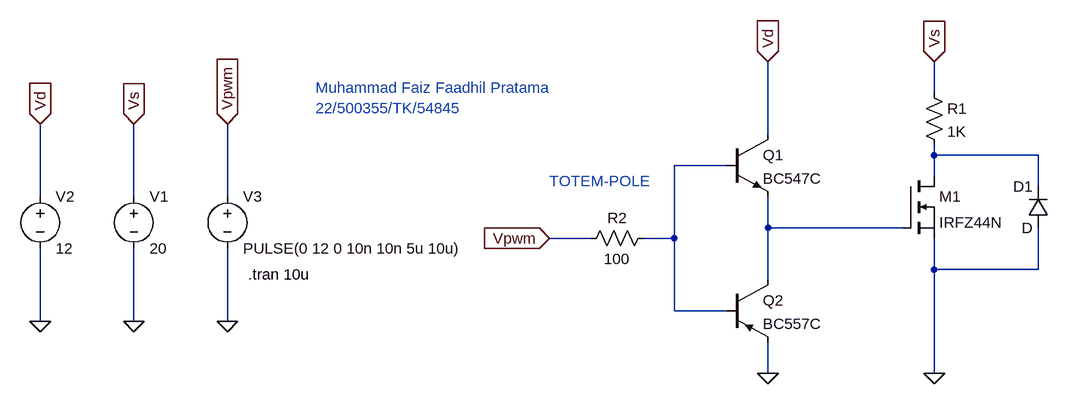
[diagram p0: schematic TOTEM_POLE.asc]
TOTEM_POLE.asc, the LTspice schematic file:
Version 4
SHEET 1 932 680
WIRE 752 -384 752 -432
WIRE 496 -320 496 -432
WIRE 752 -288 752 -304
WIRE 912 -288 752 -288
WIRE 432 -272 352 -272
WIRE 752 -256 752 -288
WIRE 912 -240 912 -288
WIRE -624 -224 -624 -336
WIRE -480 -224 -480 -336
WIRE -336 -224 -336 -336
WIRE 496 -176 496 -224
WIRE 704 -176 496 -176
WIRE 224 -160 160 -160
WIRE 352 -160 352 -272
WIRE 352 -160 304 -160
WIRE 752 -112 752 -160
WIRE 912 -112 912 -176
WIRE 912 -112 752 -112
WIRE 496 -96 496 -176
WIRE 352 -48 352 -160
WIRE 432 -48 352 -48
WIRE -624 -32 -624 -144
WIRE -480 -32 -480 -144
WIRE -336 -32 -336 -144
WIRE 496 48 496 0
WIRE 752 48 752 -112
FLAG 496 48 0
FLAG 752 48 0
FLAG 496 -432 Vd
IOPIN 496 -432 In
FLAG 752 -432 Vs
IOPIN 752 -432 In
FLAG 160 -160 Vpwm
IOPIN 160 -160 In
FLAG -480 -336 Vs
IOPIN -480 -336 In
FLAG -624 -336 Vd
IOPIN -624 -336 In
FLAG -624 -32 0
FLAG -480 -32 0
FLAG -336 -336 Vpwm
IOPIN -336 -336 In
FLAG -336 -32 0
SYMBOL npn 432 -320 R0
SYMATTR InstName Q1
SYMATTR Value BC547C
SYMBOL pnp 432 -96 R0
SYMATTR InstName Q2
SYMATTR Value BC557C
SYMBOL nmos 704 -256 R0
SYMATTR InstName M1
SYMATTR Value IRFZ44N
SYMBOL res 736 -400 R0
SYMATTR InstName R1
SYMATTR Value 1K
SYMBOL res 320 -176 R90
WINDOW 0 0 56 VBottom 2
WINDOW 3 32 56 VTop 2
SYMATTR InstName R2
SYMATTR Value 100
SYMBOL diode 928 -176 R180
WINDOW 0 24 64 Left 2
WINDOW 3 24 0 Left 2
SYMATTR InstName D1
SYMBOL voltage -480 -240 R0
WINDOW 123 0 0 Left 0
WINDOW 39 0 0 Left 0
SYMATTR InstName V1
SYMATTR Value 20
SYMBOL voltage -624 -240 R0
WINDOW 123 0 0 Left 0
WINDOW 39 0 0 Left 0
SYMATTR InstName V2
SYMATTR Value 12
SYMBOL voltage -336 -240 R0
WINDOW 123 0 0 Left 0
WINDOW 39 0 0 Left 0
SYMATTR InstName V3
SYMATTR Value PULSE(0 12 0 10n 10n 5u 10u)
TEXT 160 -248 Left 2 ;TOTEM-POLE
TEXT -304 -104 Left 2 !.tran 10u
TEXT -200 -392 Left 2 ;Muhammad Faiz Faadhil Pratama\n22/500355/TK/54845

The netlist it stands for:
* TOTEM_POLE.asc
Q1 Vd N002 N003 0 BC547C
Q2 N003 N002 0 0 BC557C
M1 N001 N003 0 0 IRFZ44N
R1 Vs N001 1K
R2 N002 Vpwm 100
D1 0 N001 D
V1 Vs 0 20
V2 Vd 0 12
V3 Vpwm 0 PULSE(0 12 0 10n 10n 5u 10u)
.model D D
.lib standard.dio
.model NPN NPN
.model PNP PNP
.lib standard.bjt
.model NMOS NMOS
.model PMOS PMOS
.lib standard.mos
* TOTEM-POLE
.tran 10u
* Muhammad Faiz Faadhil Pratama
* 22/500355/TK/54845
.backanno
.end